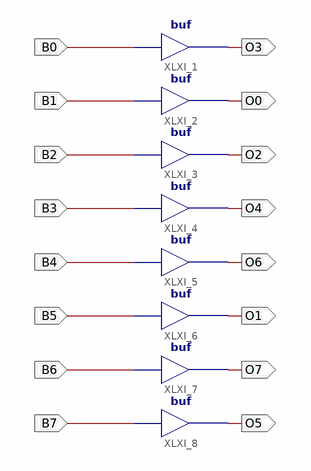
[diagram p0: schematic sheet 1]
// Xilinx ISE schematic IP.sch (xc9500xl) as structural Verilog: 8 symbols, 16 ports
module IP (
  input  B0,
  input  B1,
  input  B2,
  input  B3,
  input  B4,
  input  B5,
  input  B6,
  input  B7,
  output O3,
  output O0,
  output O2,
  output O4,
  output O6,
  output O1,
  output O7,
  output O5
);

  buf XLXI_1 (O3, B0);
  buf XLXI_2 (O0, B1);
  buf XLXI_3 (O2, B2);
  buf XLXI_4 (O4, B3);
  buf XLXI_5 (O6, B4);
  buf XLXI_6 (O1, B5);
  buf XLXI_7 (O7, B6);
  buf XLXI_8 (O5, B7);
endmodule
